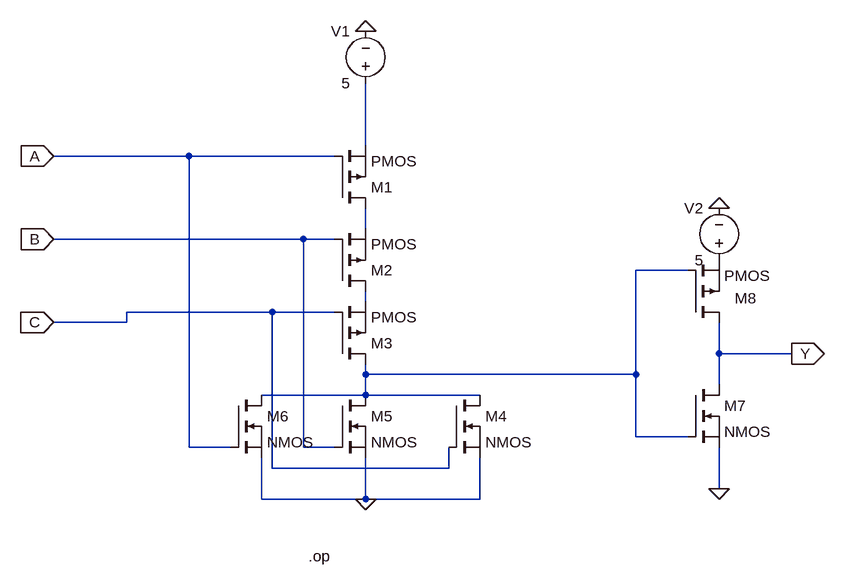
[diagram p0: schematic OR.asc]
OR.asc, the LTspice schematic file:
Version 4
SHEET 1 976 680
WIRE 176 -528 176 -624
WIRE -96 -512 -304 -512
WIRE 128 -512 -96 -512
WIRE 176 -400 176 -432
WIRE 80 -384 -304 -384
WIRE 128 -384 80 -384
WIRE 672 -336 592 -336
WIRE 176 -288 176 -304
WIRE 32 -272 -192 -272
WIRE 128 -272 32 -272
WIRE -192 -256 -192 -272
WIRE -192 -256 -304 -256
WIRE 720 -208 720 -256
WIRE 832 -208 720 -208
WIRE 176 -176 176 -192
WIRE 592 -176 592 -336
WIRE 592 -176 176 -176
WIRE 720 -160 720 -208
WIRE 176 -144 176 -176
WIRE 176 -144 16 -144
WIRE 352 -144 176 -144
WIRE 176 -128 176 -144
WIRE 592 -80 592 -176
WIRE 672 -80 592 -80
WIRE -96 -64 -96 -512
WIRE -32 -64 -96 -64
WIRE 80 -64 80 -384
WIRE 128 -64 80 -64
WIRE 32 -32 32 -272
WIRE 304 -32 304 -64
WIRE 304 -32 32 -32
WIRE 720 0 720 -64
WIRE 16 16 16 -48
WIRE 176 16 176 -48
WIRE 176 16 16 16
WIRE 352 16 352 -48
WIRE 352 16 176 16
FLAG -304 -512 A
IOPIN -304 -512 In
FLAG -304 -384 B
IOPIN -304 -384 In
FLAG -304 -256 C
IOPIN -304 -256 In
FLAG 832 -208 Y
IOPIN 832 -208 Out
FLAG 176 16 0
FLAG 720 0 0
FLAG 176 -704 0
FLAG 720 -432 0
SYMBOL pmos 128 -432 M180
SYMATTR InstName M1
SYMBOL pmos 128 -304 M180
SYMATTR InstName M2
SYMBOL pmos 128 -192 M180
SYMATTR InstName M3
SYMBOL nmos 304 -144 R0
SYMATTR InstName M4
SYMBOL nmos 128 -144 R0
SYMATTR InstName M5
SYMBOL nmos -32 -144 R0
SYMATTR InstName M6
SYMBOL nmos 672 -160 R0
SYMATTR InstName M7
SYMBOL pmos 672 -256 M180
WINDOW 0 72 37 Left 2
SYMATTR InstName M8
SYMBOL voltage 176 -608 R180
WINDOW 0 24 96 Left 2
WINDOW 3 24 16 Left 2
SYMATTR InstName V1
SYMATTR Value 5
SYMBOL voltage 720 -336 R180
WINDOW 0 24 96 Left 2
WINDOW 3 24 16 Left 2
SYMATTR InstName V2
SYMATTR Value 5
TEXT 88 104 Left 2 !.op

The netlist it stands for:
* OR.asc
M1 N002 A N001 N001 PMOS
M2 N004 B N002 N002 PMOS
M3 N003 C N004 N004 PMOS
M4 N003 C 0 0 NMOS
M5 N003 B 0 0 NMOS
M6 N003 A 0 0 NMOS
M7 Y N003 0 0 NMOS
M8 Y N003 P001 P001 PMOS
V1 N001 0 5
V2 P001 0 5
.model NMOS NMOS
.model PMOS PMOS
.lib standard.mos
.op
.backanno
.end